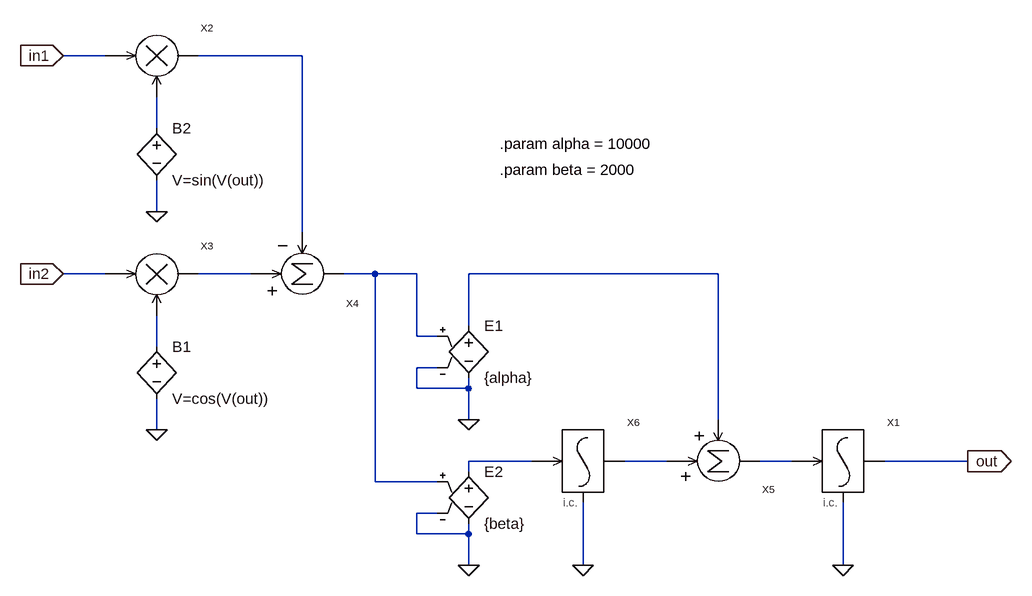
[diagram p0: schematic Angle.asc]
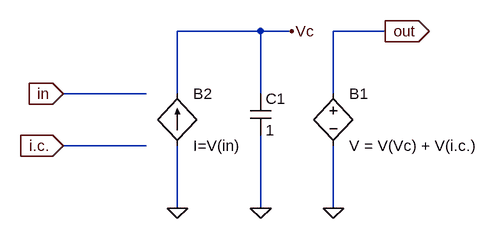
[diagram p1: sub-circuit integrator.asc]
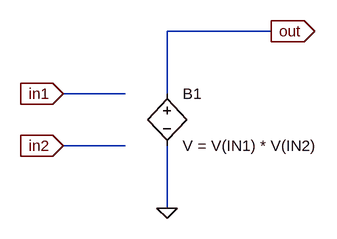
[diagram p2: sub-circuit multiplier.asc]
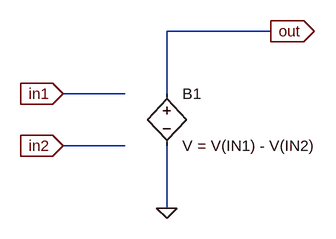
[diagram p3: sub-circuit subtractor.asc]
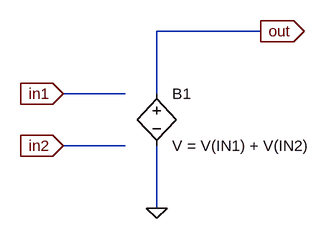
[diagram p4: sub-circuit adder.asc]
Angle.asc, the LTspice schematic file:
Version 4
SHEET 1 1392 680
WIRE -32 -208 -96 -208
WIRE 272 -208 112 -208
WIRE 48 -96 48 -144
WIRE 48 32 48 -16
WIRE 272 64 272 -208
WIRE -32 128 -96 128
WIRE 192 128 112 128
WIRE 384 128 336 128
WIRE 448 128 384 128
WIRE 912 128 528 128
WIRE 528 208 528 128
WIRE 448 224 448 128
WIRE 480 224 448 224
WIRE 48 240 48 192
WIRE 480 272 448 272
WIRE 448 304 448 272
WIRE 528 304 528 288
WIRE 528 304 448 304
WIRE 528 352 528 304
WIRE 912 352 912 128
WIRE 48 368 48 320
WIRE 624 416 528 416
WIRE 832 416 768 416
WIRE 1024 416 976 416
WIRE 1296 416 1168 416
WIRE 528 432 528 416
WIRE 384 448 384 128
WIRE 480 448 384 448
WIRE 480 496 448 496
WIRE 448 528 448 496
WIRE 528 528 528 512
WIRE 528 528 448 528
WIRE 528 576 528 528
WIRE 704 576 704 480
WIRE 1104 576 1104 480
FLAG 1104 576 0
FLAG 1296 416 out
IOPIN 1296 416 Out
FLAG 48 368 0
FLAG 48 32 0
FLAG -96 -208 in1
IOPIN -96 -208 In
FLAG -96 128 in2
IOPIN -96 128 In
FLAG 528 352 0
FLAG 704 576 0
FLAG 528 576 0
SYMBOL Integrator 1104 416 R0
SYMATTR InstName X1
SYMBOL bv 48 224 R0
SYMATTR InstName B1
SYMATTR Value V=cos(V(out))
SYMBOL bv 48 -112 R0
SYMATTR InstName B2
SYMATTR Value V=sin(V(out))
SYMBOL Multiplier 48 -208 R0
SYMATTR InstName X2
SYMBOL Multiplier 48 128 R0
SYMATTR InstName X3
SYMBOL Subtractor 272 128 M180
SYMATTR InstName X4
SYMBOL Adder 912 416 M180
SYMATTR InstName X5
SYMBOL e 528 192 R0
SYMATTR InstName E1
SYMATTR Value {alpha}
SYMBOL Integrator 704 416 R0
SYMATTR InstName X6
SYMBOL e 528 416 R0
SYMATTR InstName E2
SYMATTR Value {beta}
TEXT 576 -72 Left 0 !.param alpha = 10000
TEXT 576 -32 Left 0 !.param beta = 2000

integrator.asc, the sub-circuit schematic file:
Version 4
SHEET 1 880 680
WIRE 320 32 192 32
WIRE 368 32 320 32
WIRE 512 32 432 32
WIRE 144 128 16 128
WIRE 192 128 192 32
WIRE 320 128 320 32
WIRE 432 128 432 32
WIRE 144 208 16 208
WIRE 192 304 192 208
WIRE 320 304 320 192
WIRE 432 304 432 208
FLAG 16 128 in
IOPIN 16 128 In
FLAG 432 304 0
FLAG 512 32 out
IOPIN 512 32 Out
FLAG 192 304 0
FLAG 320 304 0
FLAG 368 32 Vc
FLAG 16 208 i.c.
IOPIN 16 208 In
SYMBOL bv 432 112 R0
SYMATTR InstName B1
SYMATTR Value V = V(Vc) + V(i.c.)
SYMBOL bi2 192 128 R0
SYMATTR InstName B2
SYMATTR Value I=V(in)
SYMBOL cap 304 128 R0
SYMATTR InstName C1
SYMATTR Value 1

multiplier.asc, the sub-circuit schematic file:
Version 4
SHEET 1 880 680
WIRE 640 32 480 32
WIRE 416 128 320 128
WIRE 480 128 480 32
WIRE 416 208 320 208
WIRE 480 304 480 208
FLAG 320 208 in2
IOPIN 320 208 In
FLAG 320 128 in1
IOPIN 320 128 In
FLAG 480 304 0
FLAG 640 32 out
IOPIN 640 32 Out
SYMBOL bv 480 112 R0
SYMATTR InstName B1
SYMATTR Value V = V(IN1) * V(IN2)

subtractor.asc, the sub-circuit schematic file:
Version 4
SHEET 1 880 680
WIRE 640 32 480 32
WIRE 416 128 320 128
WIRE 480 128 480 32
WIRE 416 208 320 208
WIRE 480 304 480 208
FLAG 320 208 in2
IOPIN 320 208 In
FLAG 320 128 in1
IOPIN 320 128 In
FLAG 480 304 0
FLAG 640 32 out
IOPIN 640 32 Out
SYMBOL bv 480 112 R0
SYMATTR InstName B1
SYMATTR Value V = V(IN1) - V(IN2)

adder.asc, the sub-circuit schematic file:
Version 4
SHEET 1 880 680
WIRE 640 32 480 32
WIRE 432 128 336 128
WIRE 480 128 480 32
WIRE 432 208 336 208
WIRE 480 304 480 208
FLAG 336 208 in2
IOPIN 336 208 In
FLAG 336 128 in1
IOPIN 336 128 In
FLAG 480 304 0
FLAG 640 32 out
IOPIN 640 32 Out
SYMBOL bv 480 112 R0
SYMATTR InstName B1
SYMATTR Value V = V(IN1) + V(IN2)

The netlist it stands for:
* Angle.asc
XX1 N009 out 0 integrator
B1 N006 0 V=cos(V(out))
B2 N002 0 V=sin(V(out))
XX2 in1 N002 N001 multiplier
XX3 in2 N006 N003 multiplier
XX4 N003 N001 N004 subtractor
XX5 N008 N005 N009 adder
E1 N005 0 N004 0 {alpha}
XX6 N007 N008 0 integrator
E2 N007 0 N004 0 {beta}

* block symbol definitions
.subckt integrator in out i.c.
B1 out 0 V = V(Vc) + V(i.c.)
B2 0 Vc I=V(in)
C1 Vc 0 1
.ends integrator

.subckt multiplier in1 in2 out
B1 out 0 V = V(IN1) * V(IN2)
.ends multiplier

.subckt subtractor in1 in2 out
B1 out 0 V = V(IN1) - V(IN2)
.ends subtractor

.subckt adder in1 in2 out
B1 out 0 V = V(IN1) + V(IN2)
.ends adder

.param alpha = 10000
.param beta = 2000
.backanno
.end